# EAGLE schematic 3d_force_DACV2.4.1fix (EAGLE 9.5.2)
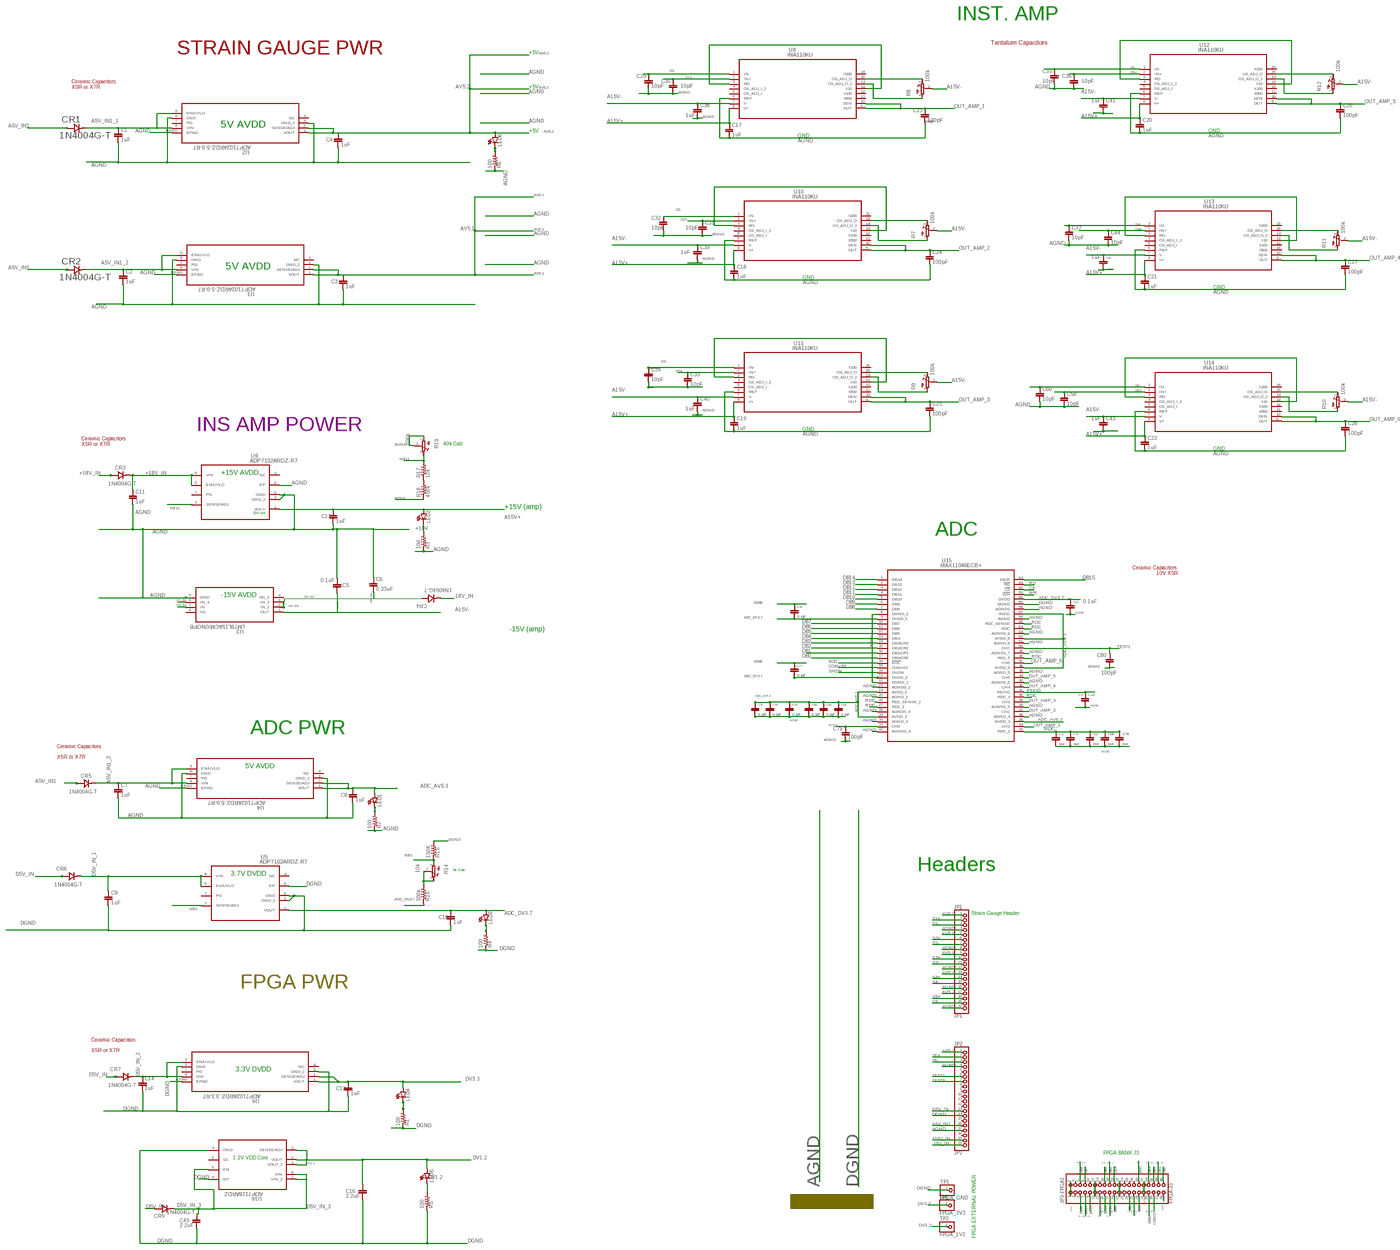
[diagram p0: schematic, sheet 1, overview]
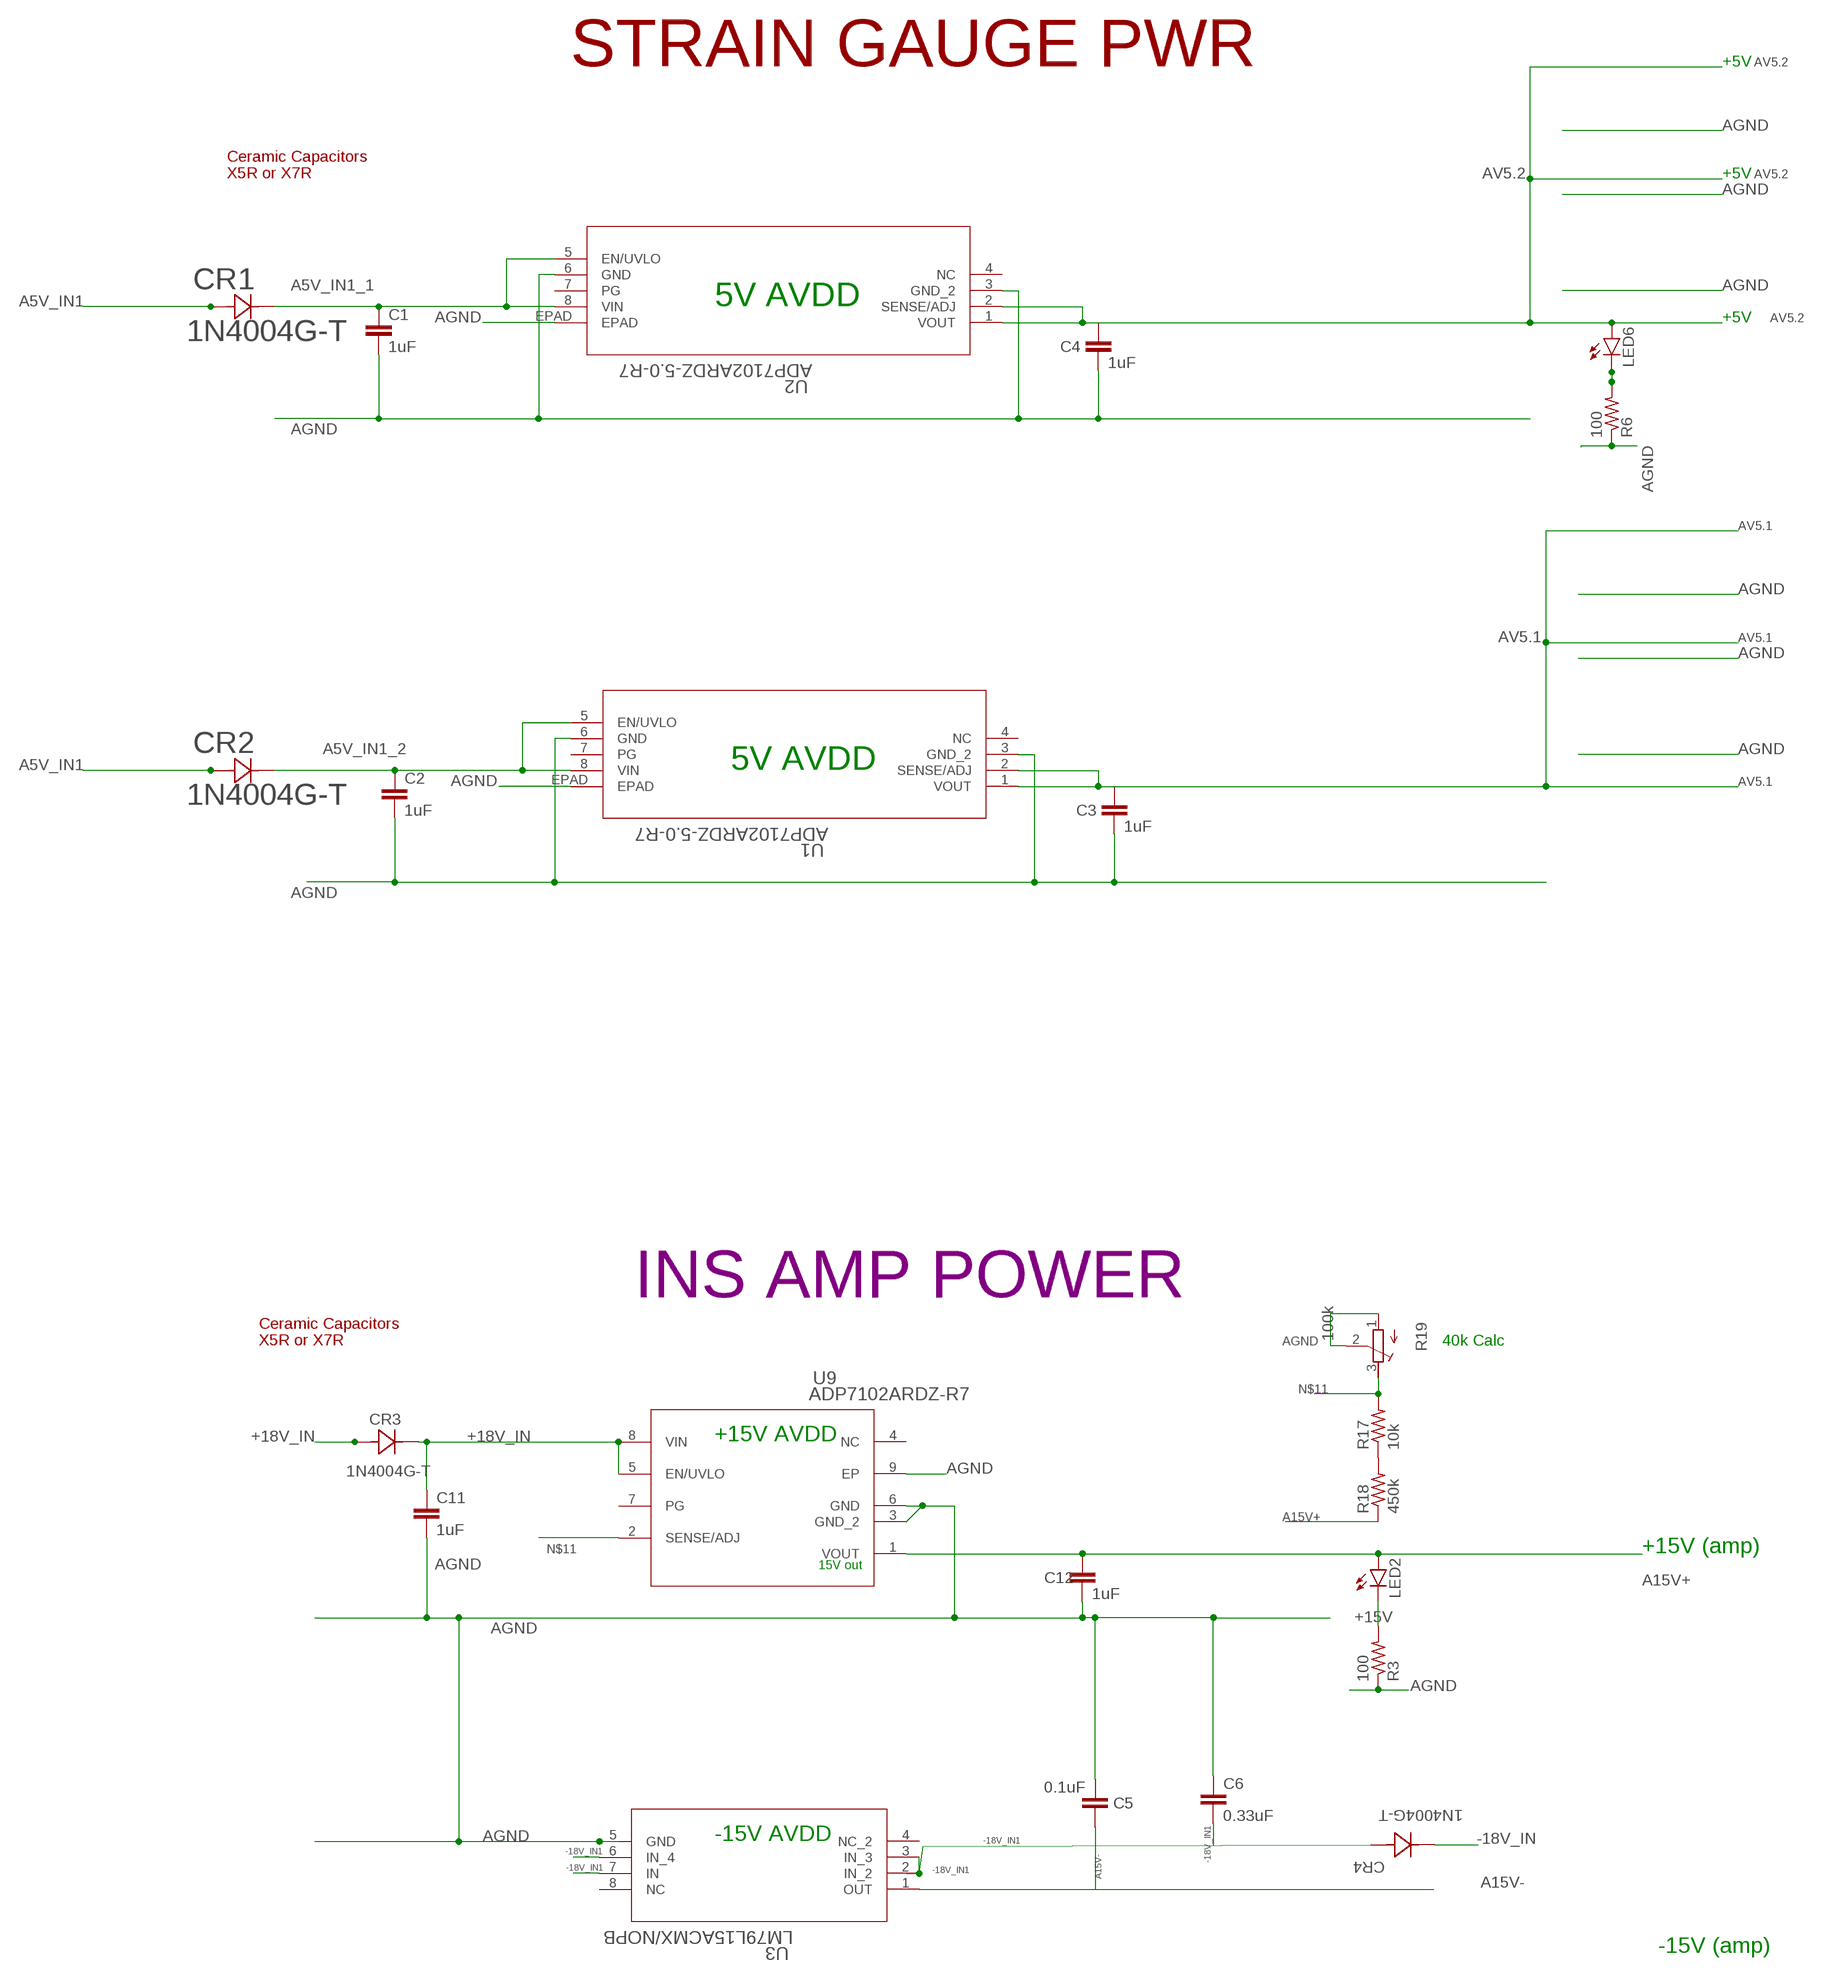
[diagram p1: schematic, sheet 1, part 1 of 4]
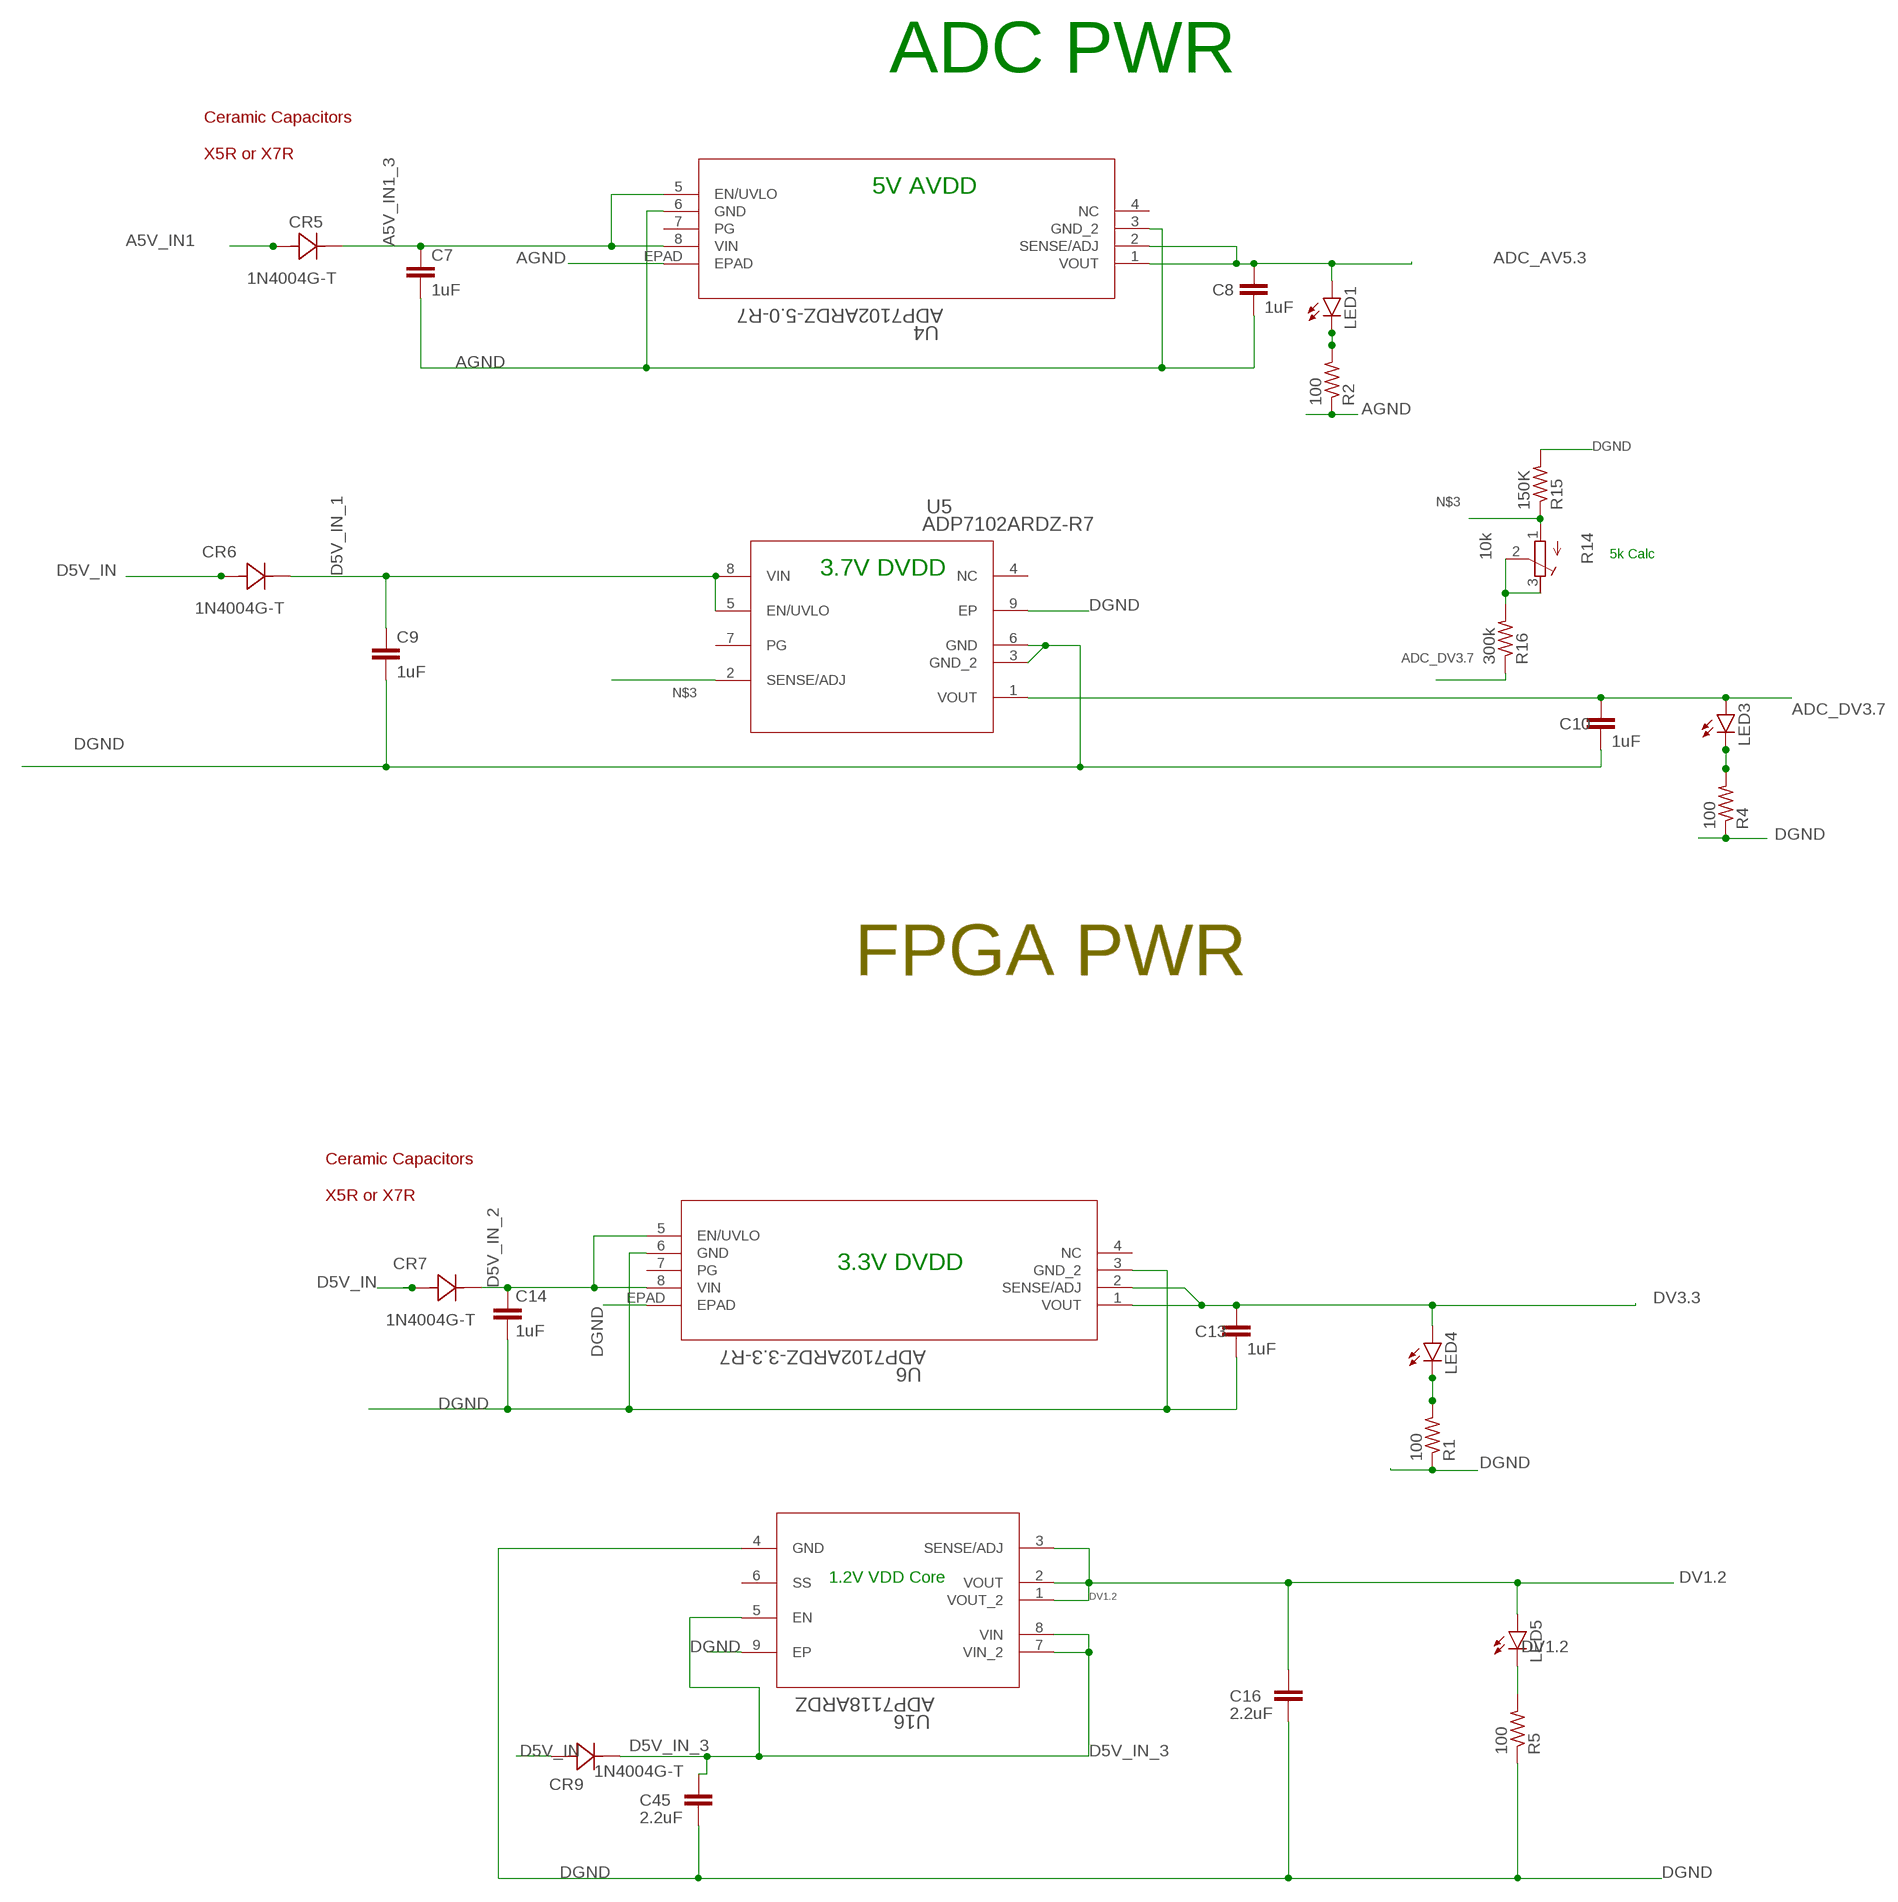
[diagram p2: schematic, sheet 1, part 2 of 4]
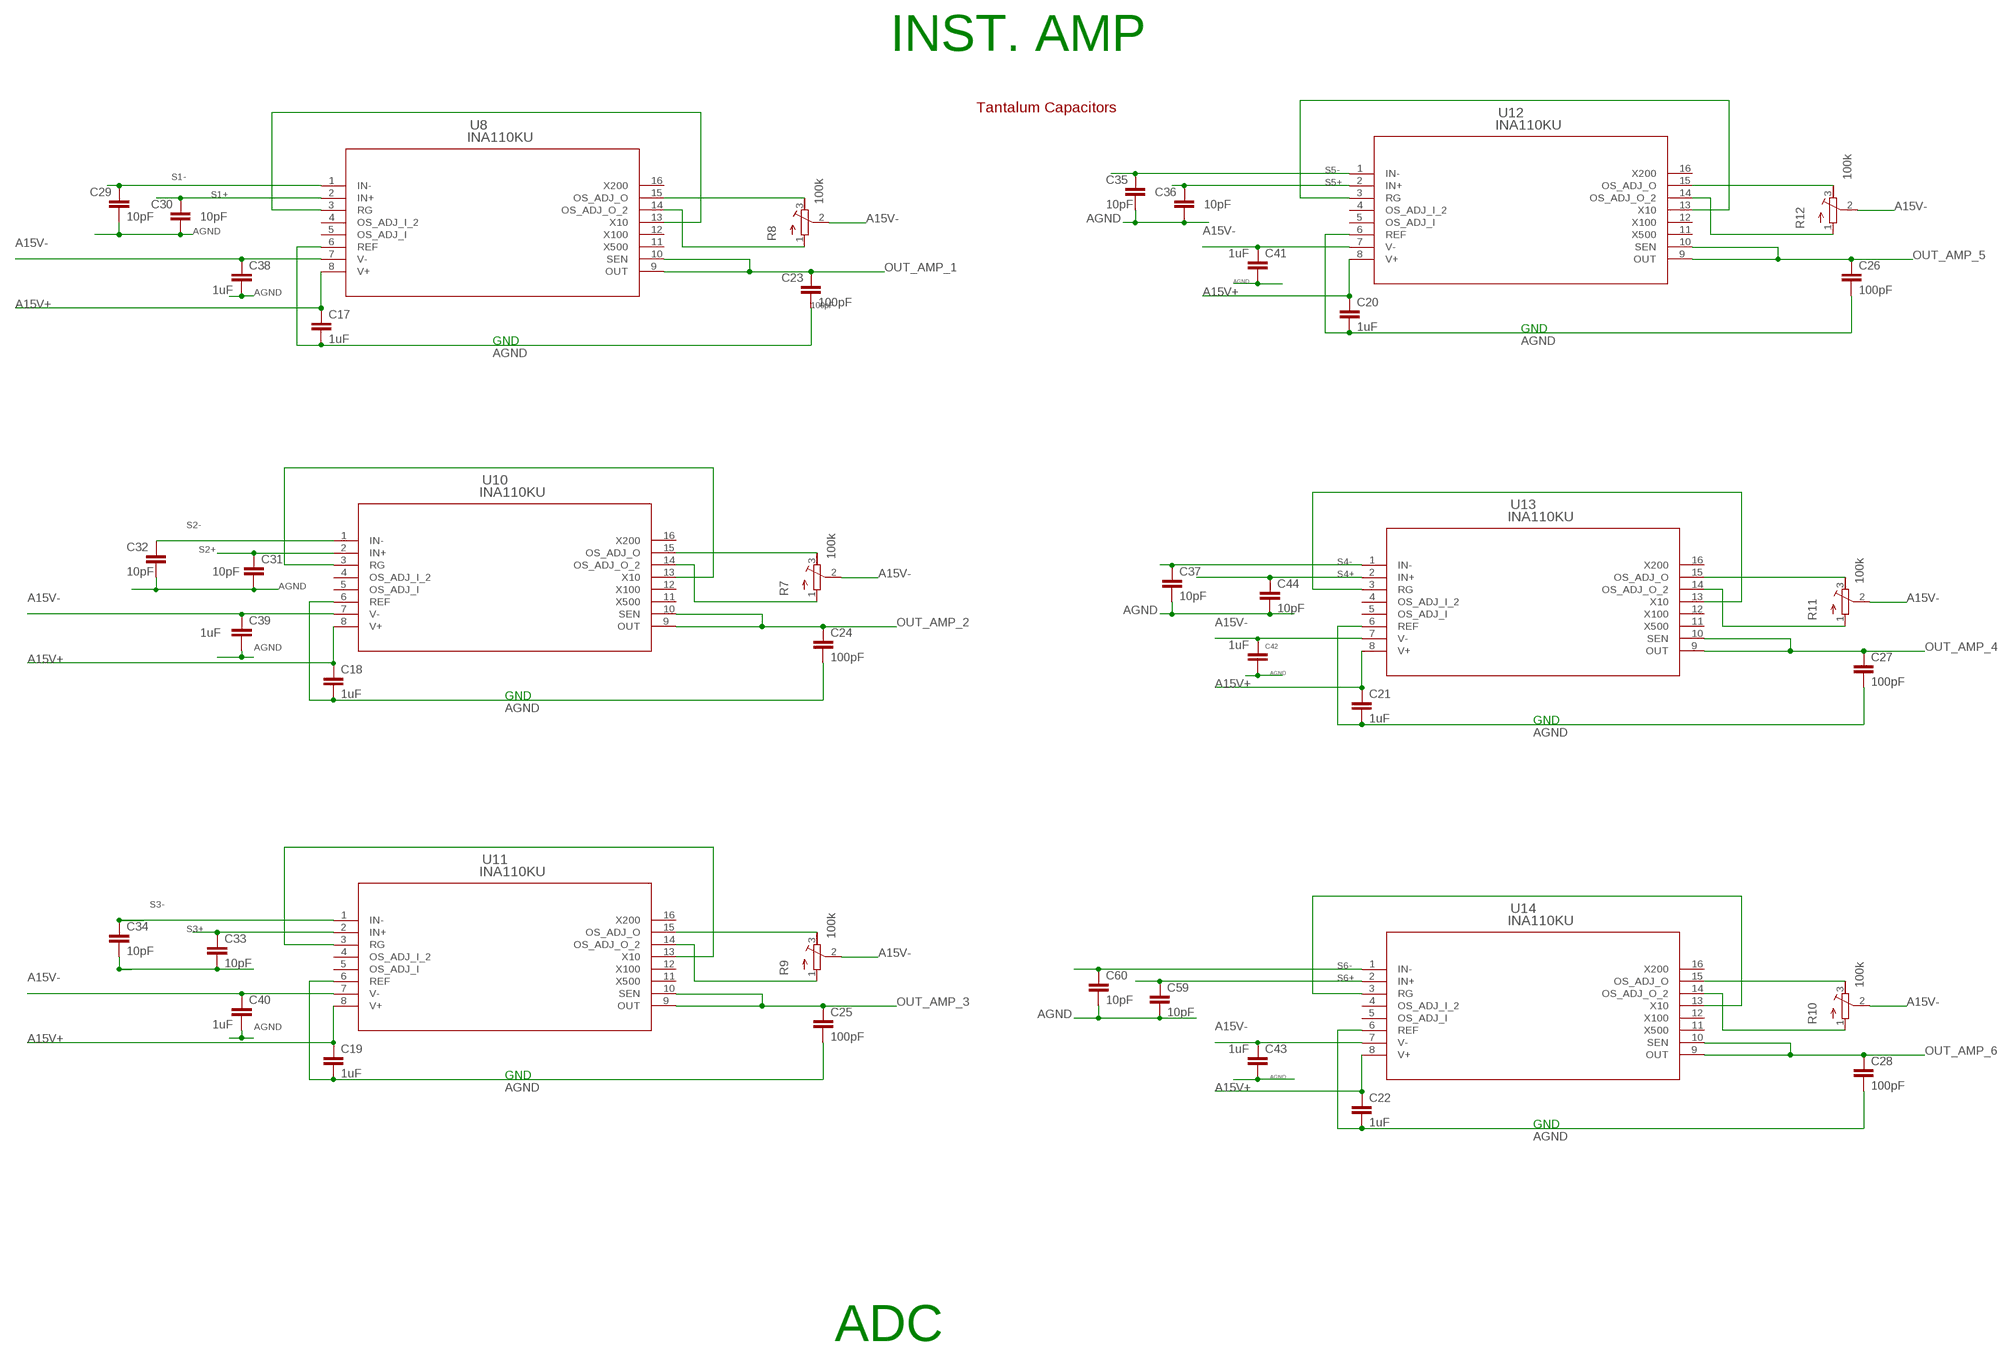
[diagram p3: schematic, sheet 1, part 3 of 4]
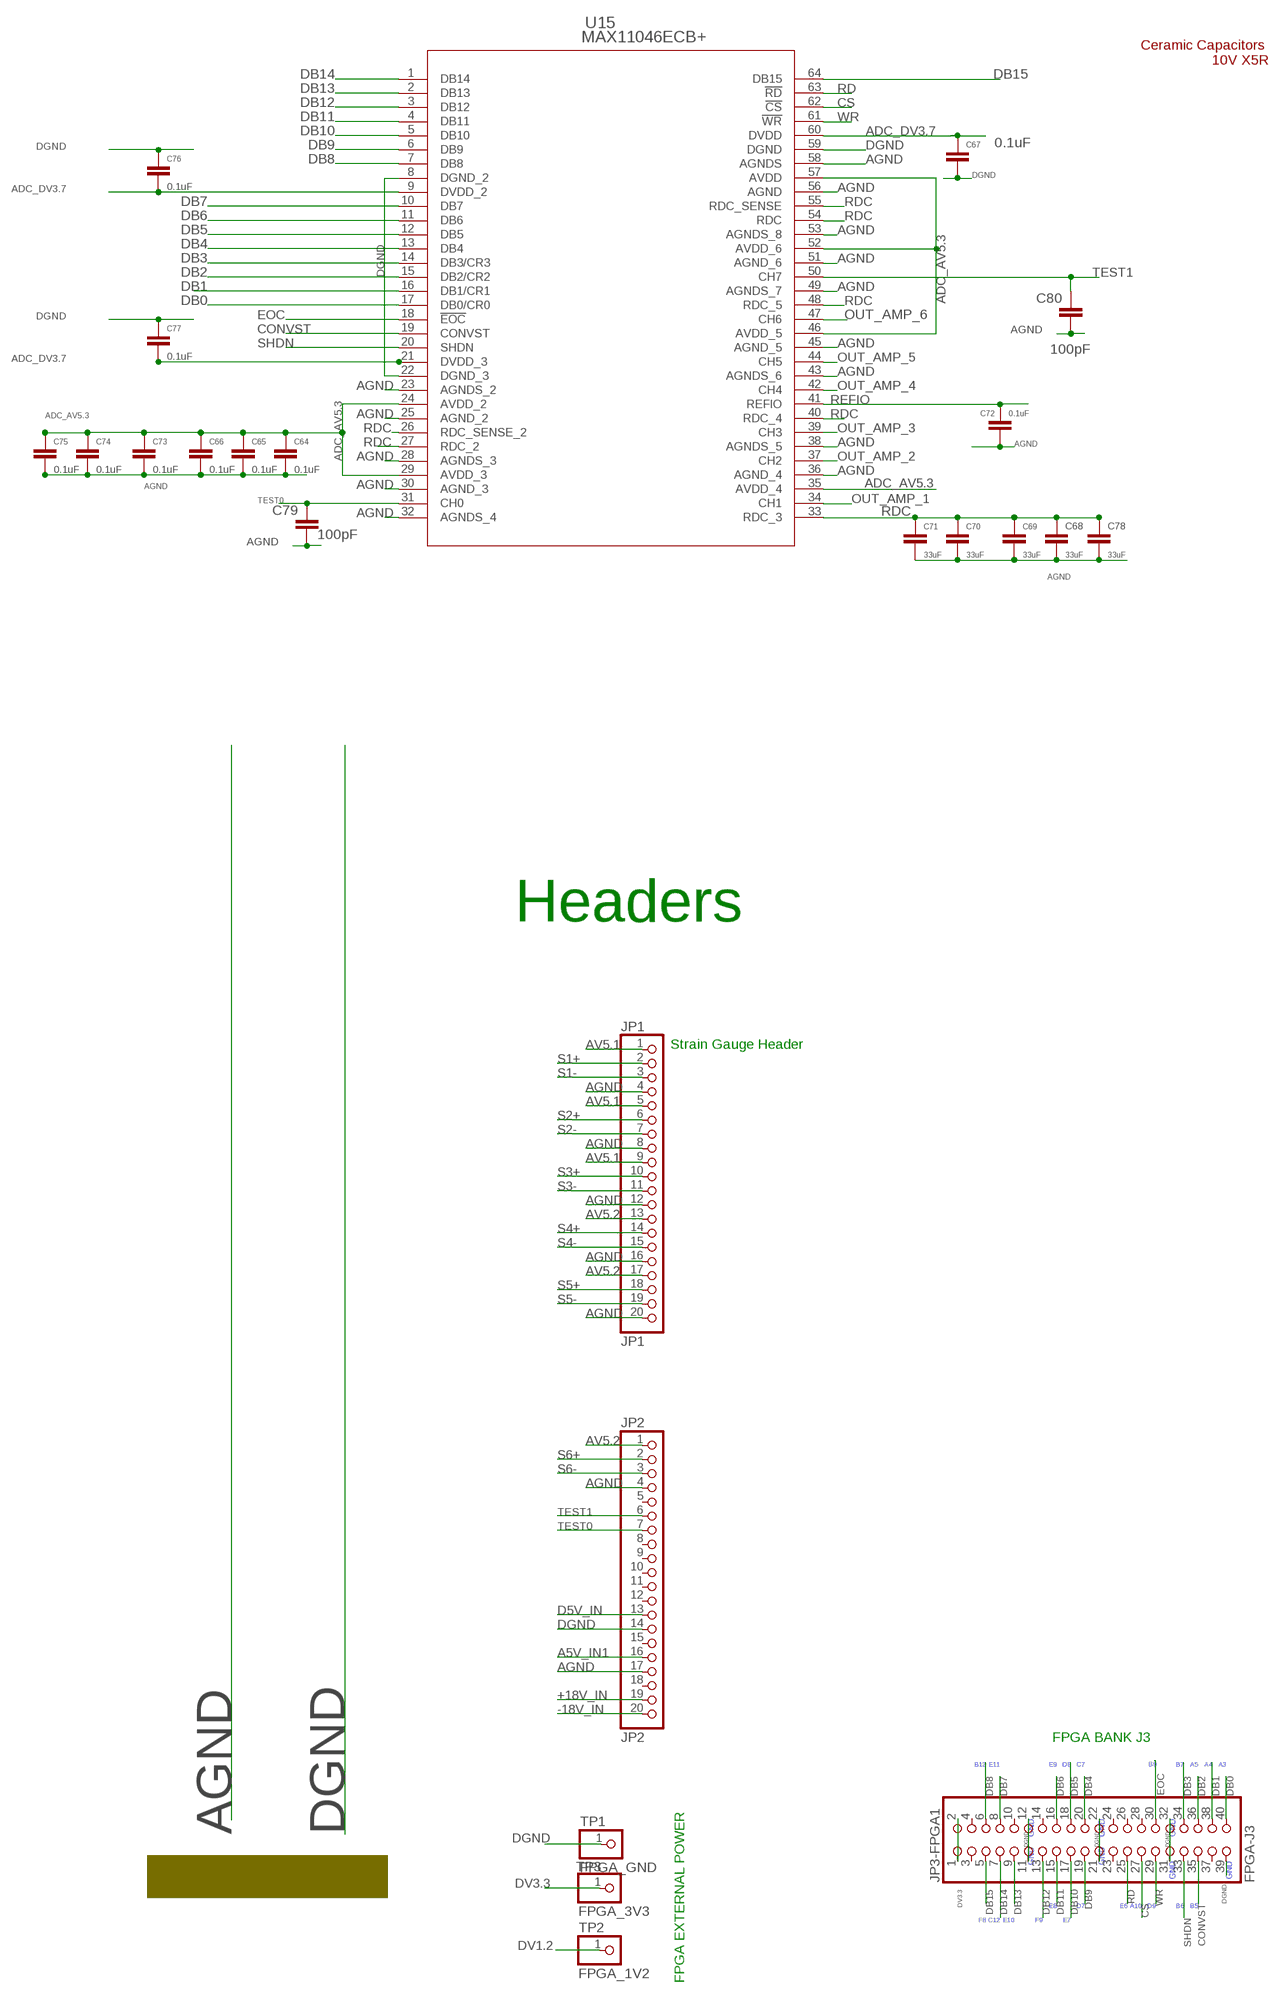
[diagram p4: schematic, sheet 1, part 4 of 4]

## Parts
C1  1uF  C-EUC1210  [C1210]
C2  1uF  C-EUC1210  [C1210]
C3  1uF  C-EUC1210  [C1210]
C4  1uF  C-EUC1210  [C1210]
C5  0.1uF  C-EUC1210  [C1210]
C6  0.33uF  C-EUC1210  [C1210]
C7  1uF  C-EUC1210  [C1210]
C8  1uF  C-EUC1210  [C1210]
C9  1uF  C-EUC1210  [C1210]
C10  1uF  C-EUC1210  [C1210]
C11  1uF  C-EUC1210  [C1210]
C12  1uF  C-EUC1210  [C1210]
C13  1uF  C-EUC1210  [C1210]
C14  1uF  C-EUC1210  [C1210]
C16  2.2uF  C-EUC1210  [C1210]
C17  1uF  C-EUC1210  [C1210]
C18  1uF  C-EUC1210  [C1210]
C19  1uF  C-EUC1210  [C1210]
C20  1uF  C-EUC1210  [C1210]
C21  1uF  C-EUC1210  [C1210]
C22  1uF  C-EUC1210  [C1210]
C23  100pF  C-EUC1210  [C1210]
C24  100pF  C-EUC1210  [C1210]
C25  100pF  C-EUC1210  [C1210]
C26  100pF  C-EUC1210  [C1210]
C27  100pF  C-EUC1210  [C1210]
C28  100pF  C-EUC1210  [C1210]
C29  10pF  C-EUC1210  [C1210]
C30  10pF  C-EUC1210  [C1210]
C31  10pF  C-EUC1210  [C1210]
C32  10pF  C-EUC1210  [C1210]
C33  10pF  C-EUC1210  [C1210]
C34  10pF  C-EUC1210  [C1210]
C35  10pF  C-EUC1210  [C1210]
C36  10pF  C-EUC1210  [C1210]
C37  10pF  C-EUC1210  [C1210]
C38  1uF  C-EUC1210  [C1210]
C39  1uF  C-EUC1210  [C1210]
C40  1uF  C-EUC1210  [C1210]
C41  1uF  C-EUC1210  [C1210]
C42  1uF  C-EUC1210  [C1210]
C43  1uF  C-EUC1210  [C1210]
C44  10pF  C-EUC1210  [C1210]
C45  2.2uF  C-EUC1210  [C1210]
C59  10pF  C-EUC1210  [C1210]
C60  10pF  C-EUC1210  [C1210]
C64  0.1uF  C-EUC1210  [C1210]
C65  0.1uF  C-EUC1210  [C1210]
C66  0.1uF  C-EUC1210  [C1210]
C67  0.1uF  C-EUC1210  [C1210]
C68  33uF  C-EUC1210  [C1210]
C69  33uF  C-EUC1210  [C1210]
C70  33uF  C-EUC1210  [C1210]
C71  33uF  C-EUC1210  [C1210]
C72  0.1uF  C-EUC1210  [C1210]
C73  0.1uF  C-EUC1210  [C1210]
C74  0.1uF  C-EUC1210  [C1210]
C75  0.1uF  C-EUC1210  [C1210]
C76  0.1uF  C-EUC1210  [C1210]
C77  0.1uF  C-EUC1210  [C1210]
C78  33uF  C-EUC1210  [C1210]
C79  100pF  C-EUC1210  [C1210]
C80  100pF  C-EUC1210  [C1210]
CR1  1N4004G-T  [DO-41]
CR2  1N4004G-T  [DO-41]
CR3  1N4004G-T  [DO-41]
CR4  1N4004G-T  [DO-41]
CR5  1N4004G-T  [DO-41]
CR6  1N4004G-T  [DO-41]
CR7  1N4004G-T  [DO-41]
CR9  1N4004G-T  [DO-41]
JP1  JP1  PINHD-1X20  [1X20]
JP2  JP2  PINHD-1X20  [1X20]
JP3-FPGA1  FPGA-J3  PINHD-2X20  [2X20]
LED1  LEDCHIPLED_1206  [CHIPLED_1206]
LED2  LEDCHIPLED_1206  [CHIPLED_1206]
LED3  LEDCHIPLED_1206  [CHIPLED_1206]
LED4  LEDCHIPLED_1206  [CHIPLED_1206]
LED5  LEDCHIPLED_1206  [CHIPLED_1206]
LED6  LEDCHIPLED_1206  [CHIPLED_1206]
R1  100  R-US_R0805  [R0805]
R2  100  R-US_R0805  [R0805]
R3  100  R-US_R0805  [R0805]
R4  100  R-US_R0805  [R0805]
R5  100  R-US_R0805  [R0805]
R6  100  R-US_R0805  [R0805]
R7  100k  R-TRIMM3296Y  [RTRIM3296Y]
R8  100k  R-TRIMM3296Y  [RTRIM3296Y]
R9  100k  R-TRIMM3296Y  [RTRIM3296Y]
R10  100k  R-TRIMM3296Y  [RTRIM3296Y]
R11  100k  R-TRIMM3296Y  [RTRIM3296Y]
R12  100k  R-TRIMM3296Y  [RTRIM3296Y]
R14  10k  R-TRIMM3296Y  [RTRIM3296Y]
R15  150K  R-US_R1210  [R1210]
R16  300k  R-US_R1210  [R1210]
R17  10k  R-US_R1210  [R1210]
R18  450k  R-US_R1210  [R1210]
R19  100k  R-TRIMM3296Y  [RTRIM3296Y]
TP1  FPGA_GND  PINHD-1X1  [1X01]
TP2  FPGA_1V2  PINHD-1X1  [1X01]
TP3  FPGA_3V3  PINHD-1X1  [1X01]
U1  ADP7102ARDZ-5.0-R7  [RD_8_2]
U2  ADP7102ARDZ-5.0-R7  [RD_8_2]
U3  LM79L15ACMX/NOPB  [M08A]
U4  ADP7102ARDZ-5.0-R7  [RD_8_2]
U5  ADP7102ARDZ-R7  [RD_8_2]
U6  ADP7102ARDZ-3.3-R7  [RD_8_2]
U8  INA110KU  [SO-G16G6.9]
U9  ADP7102ARDZ-R7  [RD_8_2]
U10  INA110KU  [SO-G16G6.9]
U11  INA110KU  [SO-G16G6.9]
U12  INA110KU  [SO-G16G6.9]
U13  INA110KU  [SO-G16G6.9]
U14  INA110KU  [SO-G16G6.9]
U15  MAX11046ECB+  [21-0084C]
U16  ADP7118ARDZ  [RD_8_1]

## Nets
+15V: LED2.C R3.2
+18V_IN: C11.1 CR3.1 CR3.2 JP2.19 U9.5(EN/UVLO) U9.8(VIN)
-18V_IN: CR4.1 JP2.20
-18V_IN1: C6.2 CR4.2 U3.2(IN_2) U3.3(IN_3) U3.6(IN_4) U3.7(IN)
A5V_IN1: CR1.2 CR2.2 CR5.2 JP2.16
A5V_IN1_1: C1.1 CR1.1 U2.5(EN/UVLO) U2.8(VIN)
A5V_IN1_2: C2.1 CR2.1 U1.5(EN/UVLO) U1.8(VIN)
A5V_IN1_3: C7.1 CR5.1 U4.5(EN/UVLO) U4.8(VIN)
A15V+: C12.1 C17.1 C18.1 C19.1 C20.1 C21.1 C22.1 LED2.A R18.1 U8.8(V+) U9.1(VOUT) U10.8(V+) U11.8(V+) U12.8(V+) U13.8(V+) U14.8(V+)
A15V-: C5.1 C38.1 C39.1 C40.1 C41.1 C42.1 C43.1 R7.2(S) R8.2(S) R9.2(S) R10.2(S) R11.2(S) R12.2(S) U3.1(OUT) U8.7(V-) U10.7(V-) U11.7(V-) U12.7(V-) U13.7(V-) U14.7(V-)
ADC_AV5.3: C8.1 C64.1 C65.1 C66.1 C73.1 C74.1 C75.1 LED1.A LED1.C R2.2 U4.1(VOUT) U4.2(SENSE/ADJ) U15.24(AVDD_2) U15.29(AVDD_3) U15.35(AVDD_4) U15.46(AVDD_5) U15.52(AVDD_6) U15.57(AVDD)
ADC_DV3.7: C10.1 C67.1 C76.2 C77.2 LED3.A LED3.C R4.2 R16.1 U5.1(VOUT) U15.9(DVDD_2) U15.21(DVDD_3) U15.60(DVDD)
AGND: C1.2 C2.2 C3.2 C4.2 C5.2 C6.1 C7.2 C8.2 C11.2 C12.2 C17.2 C18.2 C19.2 C20.2 C21.2 C22.2 C23.2 C24.2 C25.2 C26.2 C27.2 C28.2 C29.2 C30.2 C31.2 C32.2 C35.2 C36.2 C37.2 C38.2 C39.2 C40.2 C41.2 C42.2 C43.2 C44.2 C59.2 C60.2 C64.2 C65.2 C66.2 C68.2 C69.2 C70.2 C71.2 C72.2 C73.2 C74.2 C75.2 C78.2 C79.2 C80.2 JP1.4 JP1.8 JP1.12 JP1.16 JP1.20 JP2.4 JP2.17 R2.1 R3.1 R6.1 R19.1(A) R19.2(S) U1.3(GND_2) U1.6(GND) U1.EPAD U2.3(GND_2) U2.6(GND) U2.EPAD U3.5(GND) U4.3(GND_2) U4.6(GND) U4.EPAD U8.6(REF) U9.3(GND_2) U9.6(GND) U9.9(EP) U10.6(REF) U11.6(REF) U12.6(REF) U13.6(REF) U14.6(REF) U15.23(AGNDS_2) U15.25(AGND_2) U15.28(AGNDS_3) U15.30(AGND_3) U15.32(AGNDS_4) U15.36(AGND_4) U15.38(AGNDS_5) U15.43(AGNDS_6) U15.45(AGND_5) U15.49(AGNDS_7) U15.51(AGND_6) U15.53(AGNDS_8) U15.56(AGND) U15.58(AGNDS)
AV5.1: C3.1 JP1.1 JP1.5 JP1.9 U1.1(VOUT) U1.2(SENSE/ADJ)
AV5.2: C4.1 JP1.13 JP1.17 JP2.1 LED6.A LED6.C R6.2 U2.1(VOUT) U2.2(SENSE/ADJ)
CONVST: JP3-FPGA1.35 U15.19(CONVST)
CS: JP3-FPGA1.27 U15.62(!CS)
D5V_IN: CR6.2 CR7.2 CR9.2 JP2.13
D5V_IN_1: C9.1 CR6.1 U5.5(EN/UVLO) U5.8(VIN)
D5V_IN_2: C14.1 CR7.1 U6.5(EN/UVLO) U6.8(VIN)
D5V_IN_3: C45.1 CR9.1 U16.5(EN) U16.7(VIN_2) U16.8(VIN)
DB0: JP3-FPGA1.40 U15.17(DB0/CR0)
DB1: JP3-FPGA1.38 U15.16(DB1/CR1)
DB2: JP3-FPGA1.36 U15.15(DB2/CR2)
DB3: JP3-FPGA1.34 U15.14(DB3/CR3)
DB4: JP3-FPGA1.20 U15.13(DB4)
DB5: JP3-FPGA1.18 U15.12(DB5)
DB6: JP3-FPGA1.16 U15.11(DB6)
DB7: JP3-FPGA1.8 U15.10(DB7)
DB8: JP3-FPGA1.6 U15.7(DB8)
DB9: JP3-FPGA1.19 U15.6(DB9)
DB10: JP3-FPGA1.17 U15.5(DB10)
DB11: JP3-FPGA1.15 U15.4(DB11)
DB12: JP3-FPGA1.13 U15.3(DB12)
DB13: JP3-FPGA1.9 U15.2(DB13)
DB14: JP3-FPGA1.7 U15.1(DB14)
DB15: JP3-FPGA1.5 U15.64(DB15)
DGND: C9.2 C10.2 C13.2 C14.2 C16.2 C45.2 C67.2 C76.1 C77.1 JP2.14 JP3-FPGA1.11 JP3-FPGA1.12 JP3-FPGA1.21 JP3-FPGA1.22 JP3-FPGA1.31 JP3-FPGA1.32 JP3-FPGA1.39 R1.1 R4.1 R5.1 R15.2 TP1.1 U5.3(GND_2) U5.6(GND) U5.9(EP) U6.3(GND_2) U6.6(GND) U6.EPAD U15.8(DGND_2) U15.22(DGND_3) U15.59(DGND) U16.4(GND) U16.9(EP)
DV1.2: C16.1 LED5.A LED5.C R5.2 TP2.1 U16.1(VOUT_2) U16.2(VOUT) U16.3(SENSE/ADJ)
DV3.3: C13.1 JP3-FPGA1.1 JP3-FPGA1.2 LED4.A LED4.C R1.2 TP3.1 U6.1(VOUT) U6.2(SENSE/ADJ)
EOC: JP3-FPGA1.30 U15.18(!EOC)
N$2: U10.3(RG) U10.13(X10)
N$3: R14.1(A) R15.1 U5.2(SENSE/ADJ)
N$4: U11.3(RG) U11.13(X10)
N$5: U12.3(RG) U12.13(X10)
N$6: U13.3(RG) U13.13(X10)
N$7: U14.3(RG) U14.13(X10)
N$8: R7.3(E) U10.15(OS_ADJ_O)
N$9: R7.1(A) U10.14(OS_ADJ_O_2)
N$10: R8.3(E) U8.15(OS_ADJ_O)
N$11: R17.2 R19.3(E) U9.2(SENSE/ADJ)
N$12: R8.1(A) U8.14(OS_ADJ_O_2)
N$14: R9.3(E) U11.15(OS_ADJ_O)
N$15: R9.1(A) U11.14(OS_ADJ_O_2)
N$16: R10.3(E) U14.15(OS_ADJ_O)
N$17: R10.1(A) U14.14(OS_ADJ_O_2)
N$18: R11.3(E) U13.15(OS_ADJ_O)
N$19: U8.3(RG) U8.13(X10)
N$20: R11.1(A) U13.14(OS_ADJ_O_2)
N$21: R12.3(E) U12.15(OS_ADJ_O)
N$22: R12.1(A) U12.14(OS_ADJ_O_2)
N$23: C33.2 C34.2
N$25: R14.2(S) R14.3(E) R16.2
N$28: R17.1 R18.2
OUT_AMP_1: C23.1 U8.9(OUT) U8.10(SEN) U15.34(CH1)
OUT_AMP_2: C24.1 U10.9(OUT) U10.10(SEN) U15.37(CH2)
OUT_AMP_3: C25.1 U11.9(OUT) U11.10(SEN) U15.39(CH3)
OUT_AMP_4: C27.1 U13.9(OUT) U13.10(SEN) U15.42(CH4)
OUT_AMP_5: C26.1 U12.9(OUT) U12.10(SEN) U15.44(CH5)
OUT_AMP_6: C28.1 U14.9(OUT) U14.10(SEN) U15.47(CH6)
RD: JP3-FPGA1.25 U15.63(!RD)
RDC: C68.1 C69.1 C70.1 C71.1 C78.1 U15.26(RDC_SENSE_2) U15.27(RDC_2) U15.33(RDC_3) U15.40(RDC_4) U15.48(RDC_5) U15.54(RDC) U15.55(RDC_SENSE)
REFIO: C72.1 U15.41(REFIO)
S1+: C30.1 JP1.2 U8.2(IN+)
S1-: C29.1 JP1.3 U8.1(IN-)
S2+: C31.1 JP1.6 U10.2(IN+)
S2-: C32.1 JP1.7 U10.1(IN-)
S3+: C33.1 JP1.10 U11.2(IN+)
S3-: C34.1 JP1.11 U11.1(IN-)
S4+: C44.1 JP1.14 U13.2(IN+)
S4-: C37.1 JP1.15 U13.1(IN-)
S5+: C36.1 JP1.18 U12.2(IN+)
S5-: C35.1 JP1.19 U12.1(IN-)
S6+: C59.1 JP2.2 U14.2(IN+)
S6-: C60.1 JP2.3 U14.1(IN-)
SHDN: JP3-FPGA1.33 U15.20(SHDN)
TEST0: C79.1 JP2.7 U15.31(CH0)
TEST1: C80.1 JP2.6 U15.50(CH7)
WR: JP3-FPGA1.29 U15.61(!WR)
Unconnected: JP2.5 JP2.8 JP2.9 JP2.10 JP2.11 JP2.12 JP2.15 JP2.18 JP3-FPGA1.3 JP3-FPGA1.4 JP3-FPGA1.10 JP3-FPGA1.14 JP3-FPGA1.23 JP3-FPGA1.24 JP3-FPGA1.26 JP3-FPGA1.28 JP3-FPGA1.37 U1.4(NC) U2.4(NC) U3.4(NC_2) U3.8(NC) U4.4(NC) U5.4(NC) U5.7(PG) U6.4(NC) U8.4(OS_ADJ_I_2) U8.5(OS_ADJ_I) U8.11(X500) U8.12(X100) U8.16(X200) U9.4(NC) U9.7(PG) U10.4(OS_ADJ_I_2) U10.5(OS_ADJ_I) U10.11(X500) U10.12(X100) U10.16(X200) U11.4(OS_ADJ_I_2) U11.5(OS_ADJ_I) U11.11(X500) U11.12(X100) U11.16(X200) U12.4(OS_ADJ_I_2) U12.5(OS_ADJ_I) U12.11(X500) U12.12(X100) U12.16(X200) U13.4(OS_ADJ_I_2) U13.5(OS_ADJ_I) U13.11(X500) U13.12(X100) U13.16(X200) U14.4(OS_ADJ_I_2) U14.5(OS_ADJ_I) U14.11(X500) U14.12(X100) U14.16(X200) U16.6(SS)

## Notes on the sheet
- INST. AMP
- Tantalum Capacitors
- STRAIN GAUGE PWR | +5V
- Ceramic Capacitors
  X5R or X7R
- +5V
- 5V AVDD
- +5V | GND
- GND
- 5V AVDD
- GND
- GND
- INS AMP POWER | GND
- Ceramic Capacitors
  X5R or X7R
- 40k Calc
- GND
- +15V AVDD
- +15V (amp)
- 15V out
- ADC
- Ceramic Capacitors 
  10V X5R
- -15V AVDD
- -15V (amp)
- ADC PWR
- Ceramic Capacitors
  
  X5R or X7R
- 5V AVDD
- 5k Calc | Headers
- 3.7V DVDD
- Strain Gauge Header
- FPGA PWR
- Ceramic Capacitors 
  
  X5R or X7R
- 3.3V DVDD
- FPGA BANK J3
- 1.2V VDD Core
- B12 | E11 | E9 | D8 | C7 | B7 | A5 | A4 | A3
- B9
- GND | GND | GND
- GND | GND
- GND | GND
- E8 | D7 | E6 | A10 | D9 | B6 | B5
- F8 | C12 | E10 | F9 | E7
- FPGA EXTERNAL POWER

## Power pins joined to a net without a drawn wire
PG: U1.7(PG) U2.7(PG) U4.7(PG) U6.7(PG)

## Library data of the parts
C1 C2 C6 C7 C9 C11 C14 C16-C22 C24-C45 C59 C60 C64-C80 = rcl:C-EU: CAPACITOR, European symbol; SPICEPREFIX: C
C3-C5 C8 C10 C12 C13 = rcl:C-EU: CAPACITOR, European symbol; CAP: 1uF; SPICEPREFIX: C
C23 = rcl:C-EU: CAPACITOR, European symbol; CAP: 100pF; SPICEPREFIX: C
CR1-CR7 CR9 = 1N4004GT:1N4004G-T; MANUFACTURER_PART_NUMBER: 1N4004GT; VENDOR: Diodes Inc
JP1 JP2 = pinhead:PINHD-1X20: PIN HEADER
JP3-FPGA1 = pinhead:PINHD-2X20: PIN HEADER; SPICEPREFIX: X
LED1-LED6 = led:LED: LED OSRAM: - CHIPLED LG R971, LG N971, LY N971, LG Q971, LY Q971, LO R971, LY R971 LH N974, LH R974 LS Q976, LO Q976, LY Q976 LO Q996 - Hyper CHIPLED LW Q18S LB Q993, LB Q99A, LB R99A - SideLED LS A670, LO A670, LY A670, LG A670, LP A670 LB A673, LV A673, LT A673, LW A673 LH A674 LY A675 LS A676, LA A676, LO A676, LY A676, LW A676 LS A679, LY A679, LG A679 - Hyper Micro SIDELED® LS Y876, LA Y876, LO Y876, LY Y876 LT Y87S - SmartLED LW L88C, LW L88S LB L89C, LB L89S, LG L890 LS L89K, LO L89K, LY L89K LS L896, LA L896, LO L896, LY L896 - TOPLED LS T670, LO T670, LY T670, LG T670, LP T670 LSG T670, LSP T670, LSY T670, LOP T670, LYG T670 LG T671, LOG T671, LSG T671 LB T673, LV T673, LT T673, LW T673 LH T674 LS T676, LA T676, LO T676, LY T676, LB T676, LH T676, LSB T676, LW T676 LB T67C, LV T67C, LT T67C, LS T67K, LO T67K, LY T67K, LW E67C LS E67B, LA E67B, LO E67B, LY E67B, LB E67C, LV E67C, LT E67C LW T67C LS T679, LY T679, LG T679 LS T770, LO T770, LY T770, LG T770, LP T770 LB T773, LV T773, LT T773, LW T773 LH T774 LS E675, LA E675, LY E675, LS T675 LS T776, LA T776, LO T776, LY T776, LB T776 LHGB T686 LT T68C, LB T68C - Hyper Mini TOPLED® LB M676 - Mini TOPLED Santana® LG M470 LS M47K, LO M47K, LY M47K Source: http://www.osram.convergy.de LUXEON: - LUMILED® LXK2-PW12-R00, LXK2-PW12-S00, LXK2-PW14-U00, LXK2-PW14-V00 LXK2-PM12-R00, LXK2-PM12-S00, LXK2-PM14-U00 LXK2-PE12-Q00, LXK2-PE12-R00, LXK2-PE12-S00, LXK2-PE14-T00, LXK2-PE14-U00 LXK2-PB12-K00, LXK2-PB12-L00, LXK2-PB12-M00, LXK2-PB14-N00, LXK2-PB14-P00, LXK2-PB14-Q00 LXK2-PR12-L00, LXK2-PR12-M00, LXK2-PR14-Q00, LXK2-PR14-R00 LXK2-PD12-Q00, LXK2-PD12-R00, LXK2-PD12-S00 LXK2-PH12-R00, LXK2-PH12-S00 LXK2-PL12-P00, LXK2-PL12-Q00, LXK2-PL12-R00 Source: www.luxeon.com KINGBRIGHT: KA-3528ASYC Source: www.kingbright.com
R1-R6 R16 = rcl:R-US_: RESISTOR, American symbol; R: 305k; SPICEPREFIX: R
R7-R12 R14 R19 = rcl:R-TRIMM: Trimm resistor; SPICEMODEL: X; SPICEPREFIXL: POT
R15 R17 R18 = rcl:R-US_: RESISTOR, American symbol; SPICEPREFIX: R
TP1-TP3 = pinhead:PINHD-1X1: PIN HEADER
U1 U2 U4 = ADP7102ARDZ5.0R7:ADP7102ARDZ-5.0-R7; MANUFACTURER_PART_NUMBER: ADP7102ARDZ5.0R7; VENDOR: Analog Devices Inc
U3 = LM79L15ACMXNOPB:LM79L15ACMX/NOPB; BUILT_BY: EMA_UL_Team; MANUFACTURER_PART_NUMBER: LM79L15ACMX/NOPB; VENDOR: Texas Instruments
U5 U9 = ADP7102ARDZR7:ADP7102ARDZ-R7; MANUFACTURER_PART_NUMBER: ADP7102ARDZR7; VENDOR: Analog Devices Inc
U6 = ADP7102ARDZ3.3R7:ADP7102ARDZ-3.3-R7; MANUFACTURER_PART_NUMBER: ADP7102ARDZ3.3R7; VENDOR: Analog Devices Inc
U8 U10-U14 = INA110KU:INA110KU; MANUFACTURER_PART_NUMBER: INA110KU; VENDOR: Texas Instruments
U15 = MAX11046B:MAX11046ECB+; MANUFACTURER_PART_NUMBER: MAX11046ECB+; VENDOR: Maxim Integrated Products
U16 = ADP7118ARDZ:ADP7118ARDZ; MANUFACTURER_PART_NUMBER: ADP7118ARDZ; VENDOR: Analog Devices Inc